# Altium schematic sheet Sheet1.SchDoc
size A
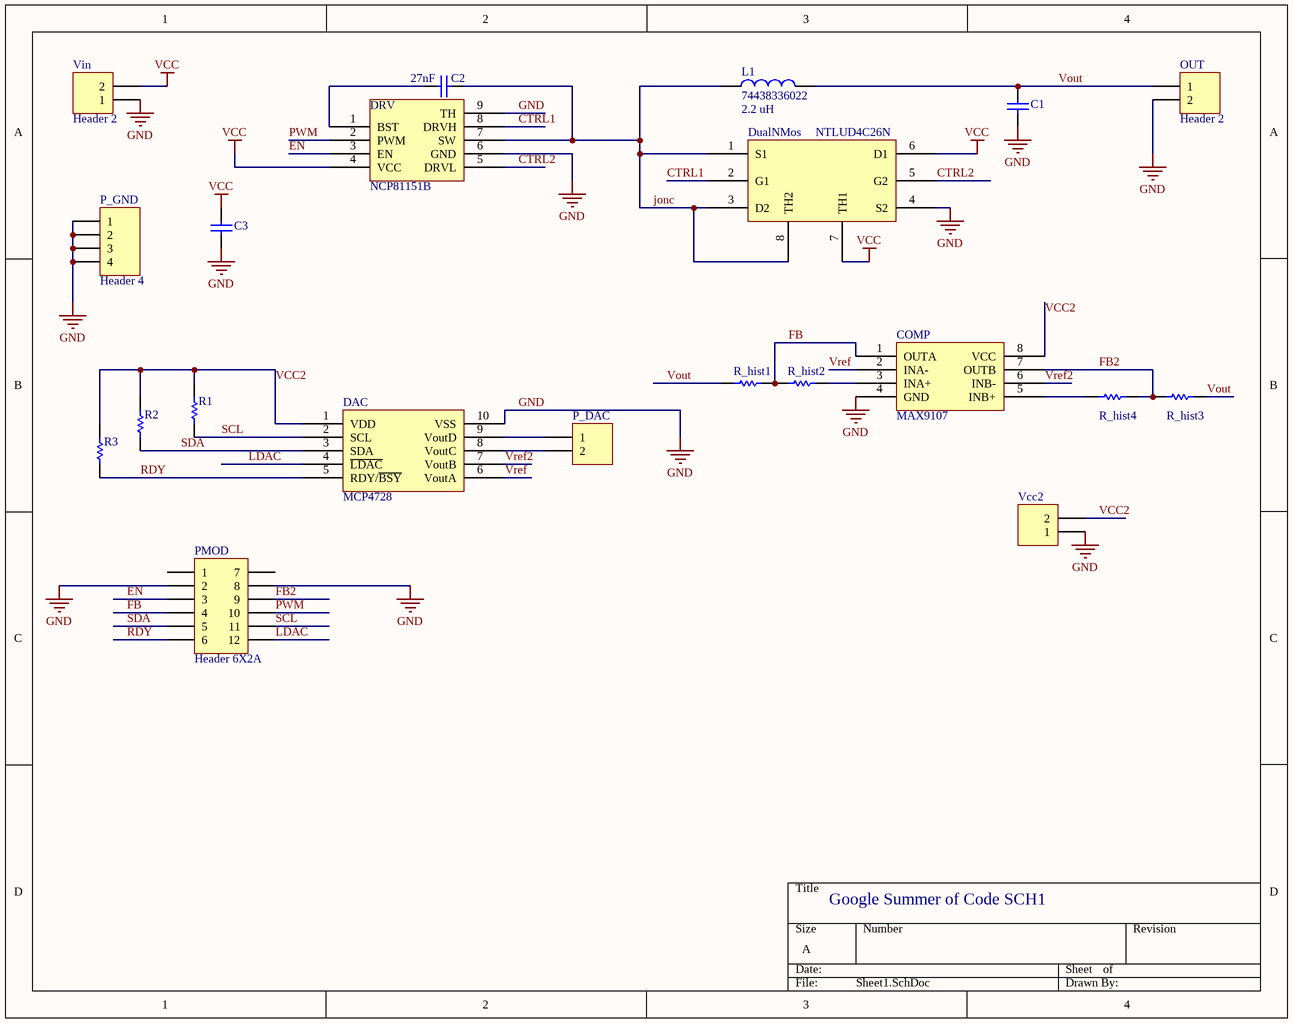
[diagram p0: Sheet1.SchDoc]

## Parts
C1  Cap  [C1210_M]  (value not drawn)
C2  value 27nF  [C0805]  (hidden comment: Cap)
C3  Cap  [C1210_M]  (value not drawn)
COMP  MAX9107  [SOT23-8]
DAC  MCP4728  [TSSOP50P500X110-10N]
DRV  NCP81151B
DualNMos  NTLUD4C26N
L1  74438336022  value 2.2 uH  [WE-MAPI_3020]
OUT  Header 2  [HDR1X2]
P_DAC  Header 2  [HDR1X2]  (value not drawn)
P_GND  Header 4  [HDR1X4]
PMOD  Header 6X2A  [HDR2X6_CEN]
R1  Res1  [C0805]  (value not drawn)
R2  Res1  [C0805]  (value not drawn)
R3  Res1  [C0805]  (value not drawn)
R_hist1  Res1  [C0805]  (value not drawn)
R_hist2  Res1  [C0805]  (value not drawn)
R_hist3  Res1  [C0805]  (value not drawn)
R_hist4  Res1  [C0805]  (value not drawn)
Vcc2  Header 2  [HDR1X2]  (value not drawn)
Vin  Header 2  [HDR1X2]

## Nets
GND: C1.1 C3.2 COMP.4(GND) DAC.10(VSS) DRV.6(GND) DRV.9(TH) DualNMos.4(S2) OUT.2 P_GND.1 P_GND.2 P_GND.3 P_GND.4 PMOD.2 PMOD.8 Vcc2.1 Vin.1
VCC: C3.1 DRV.4(VCC) DualNMos.6(D1) DualNMos.7(TH1) Vin.2
CTRL1: DRV.8(DRVH) DualNMos.2(G1)
CTRL2: DRV.5(DRVL) DualNMos.5(G2)
EN: DRV.3(EN) PMOD.3
FB: COMP.1(OUTA) PMOD.4 R_hist1.1 R_hist2.2
FB2: COMP.7(OUTB) PMOD.9 R_hist3.2 R_hist4.1
jonc: C2.1 DRV.7(SW) DualNMos.1(S1) DualNMos.3(D2) DualNMos.8(TH2) L1.1
LDAC: DAC.4(~{LDAC}) PMOD.12
PWM: DRV.2(PWM) PMOD.10
RDY: DAC.5(RDY/~{BSY}) PMOD.6 R3.1
SCL: DAC.2(SCL) PMOD.11 R1.1
SDA: DAC.3(SDA) PMOD.5 R2.1
VCC2: COMP.8(VCC) DAC.1(VDD) R1.2 R2.2 R3.2 Vcc2.2
Vout: C1.2 L1.2 OUT.1 R_hist1.2 R_hist3.1
Vref: COMP.2(INA-) DAC.6(VoutA)
Vref2: COMP.6(INB-) DAC.7(VoutB)
NetC2_2: C2.2 DRV.1(BST)
NetCOMP_3: COMP.3(INA+) R_hist2.1
NetCOMP_5: COMP.5(INB+) R_hist4.2
NetDAC_8: DAC.8(VoutC) P_DAC.2
NetDAC_9: DAC.9(VoutD) P_DAC.1

Not connected (* = marked no-connect by the designer): PMOD 1 7

## Notes on the sheet
- Google Summer of Code SCH1

## Library data of the parts
C1 = Cap: Capacitor; Value: 100pF; Published: 8-Jun-2000; LatestRevisionDate: 17-Jul-2002; LatestRevisionNote: Re-released for DXP Platform.; PackageReference: RAD-0.3; Publisher: Altium Limited; PackageDescription: Radial Cap, Thru-Hole; 2 Leads; 0.3 in Pin Spacing
C2 = Cap: Capacitor; Published: 8-Jun-2000; LatestRevisionDate: 17-Jul-2002; LatestRevisionNote: Re-released for DXP Platform.; PackageReference: RAD-0.3; Publisher: Altium Limited; PackageDescription: Radial Cap, Thru-Hole; 2 Leads; 0.3 in Pin Spacing
C3 = Cap: Capacitor; Value: 27nF; Published: 8-Jun-2000; LatestRevisionDate: 17-Jul-2002; LatestRevisionNote: Re-released for DXP Platform.; PackageReference: RAD-0.3; Publisher: Altium Limited; PackageDescription: Radial Cap, Thru-Hole; 2 Leads; 0.3 in Pin Spacing
L1 = 74438336022: WE-MAPI SMD Shielded Power Inductor, size 3020, 2.2 uH; RatedCurrent: 2.4 A; PublishedDate: Nov. 2016; Publisher: Wurth Elektronik; ComponentLink1Description: Manufacturer; ComponentLink1URL: http://www.we-online.de; ComponentLink2Description: Datasheet; ComponentLink2URL: http://katalog.we-online.de/pbs/datasheet/74438336022.pdf; PartNumber: 74438336022; Size: 3020
OUT P_DAC Vcc2 Vin = Header 2: Header, 2-Pin; LatestRevisionDate: 17-Jul-2002; LatestRevisionNote: Re-released for DXP Platform.; Publisher: Altium Limited
P_GND = Header 4: Header, 4-Pin; LatestRevisionDate: 17-Jul-2002; LatestRevisionNote: Re-released for DXP Platform.; Publisher: Altium Limited
PMOD = Header 6X2A: Header, 6-Pin, Dual row; LatestRevisionDate: 17-Jul-2002; LatestRevisionNote: Re-released for DXP Platform.; Publisher: Altium Limited
R1-R3 R_hist1-R_hist4 = Res1: Resistor; Value: 1K; Published: 8-Jun-2000; LatestRevisionDate: 17-Jul-2002; LatestRevisionNote: Re-released for DXP Platform.; PackageReference: AXIAL-0.3; Publisher: Altium Limited; PackageDescription: Axial Device, Thru-Hole; 2 Leads; 0.3 in Pin Spacing